# Altium schematic sheet trinamic-controller.SchDoc
size B; SheetNumber: 8; SheetTotal: 13
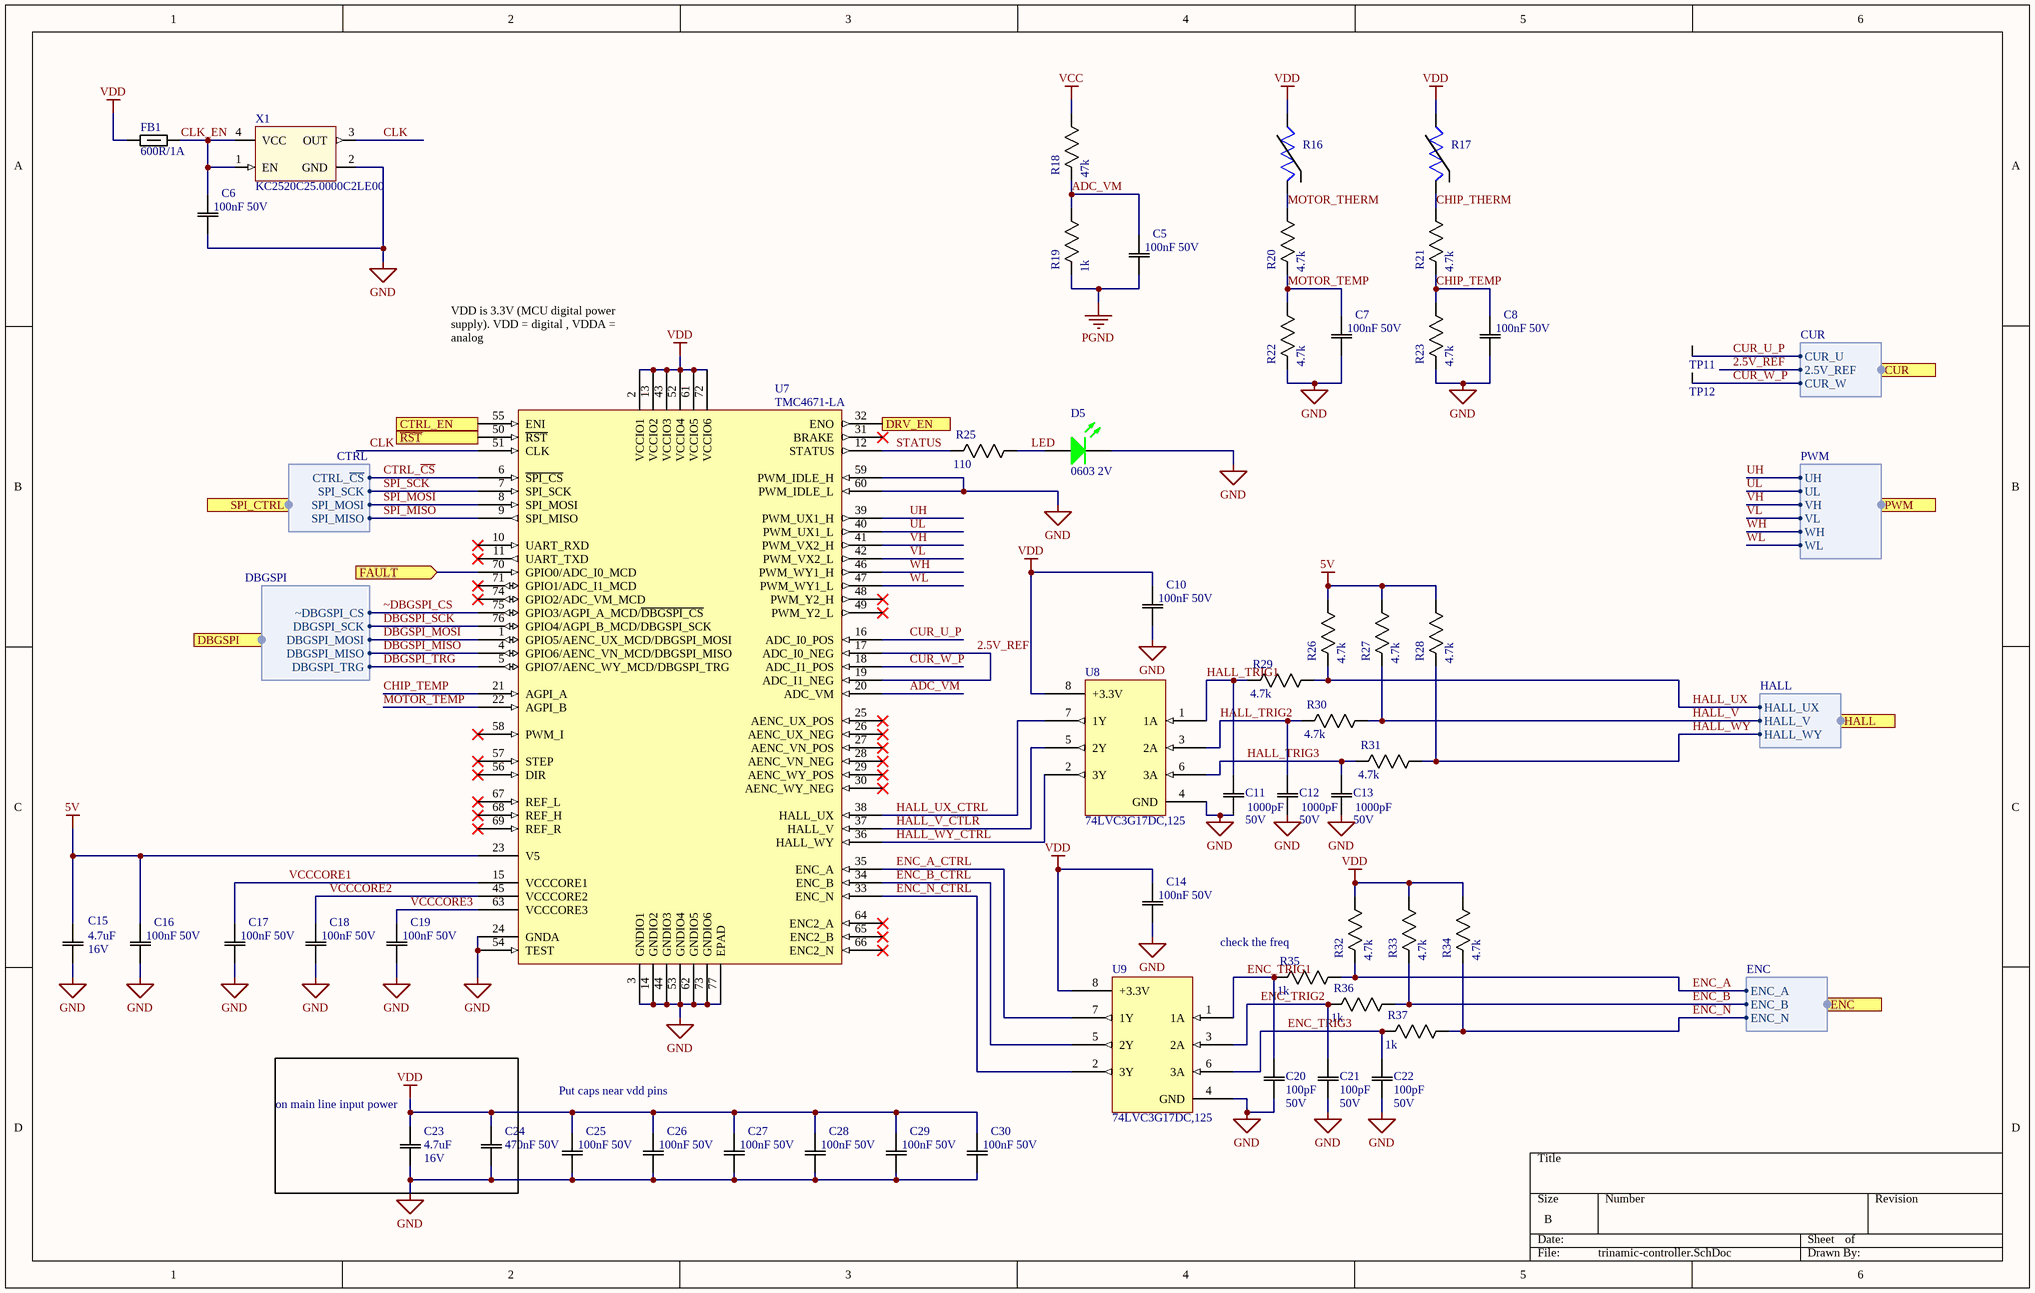
[diagram p0: trinamic-controller.SchDoc]

## Parts
C5  100nF 50V  [0603]
C6  100nF 50V  [0603]
C7  100nF 50V  [0603]
C8  100nF 50V  [0603]
C10  100nF 50V  [0603]
C11  value 1000pF  Rating: 50V  [0603]  (hidden comment: 1000pF 50V)
C12  value 1000pF  Rating: 50V  [0603]  (hidden comment: 1000pF 50V)
C13  value 1000pF  Rating: 50V  [0603]  (hidden comment: 1000pF 50V)
C14  100nF 50V  [0603]
C15  value 4.7uF  Rating: 16V  [0603]  (hidden comment: 4.7uF 16V)
C16  100nF 50V  [0603]
C17  100nF 50V  [0603]
C18  100nF 50V  [0603]
C19  100nF 50V  [0603]
C20  value 100pF  Rating: 50V  [0603]  (hidden comment: 100pF 50V)
C21  value 100pF  Rating: 50V  [0603]  (hidden comment: 100pF 50V)
C22  value 100pF  Rating: 50V  [0603]  (hidden comment: 100pF 50V)
C23  value 4.7uF  Rating: 16V  [0603]  (hidden comment: 4.7uF 16V)
C24  470nF 50V  [0603]
C25  100nF 50V  [0603]
C26  100nF 50V  [0603]
C27  100nF 50V  [0603]
C28  100nF 50V  [0603]
C29  100nF 50V  [0603]
C30  100nF 50V  [0603]
D5  0603 2V  [0603 - LED]
FB1  600R/1A  [0603]
R16  RES NTC 10k  [THERMISTOR TH]  (value not drawn)  (no BOM)
R17  RES NTC 10k  [0603]  (value not drawn)
R18  47k  [0603]
R19  1k  [0603]
R20  4.7k  [0603]
R21  4.7k  [0603]
R22  4.7k  [0603]
R23  4.7k  [0603]
R25  110  [0603]
R26  4.7k  [0603]
R27  4.7k  [0603]
R28  4.7k  [0603]
R29  4.7k  [0603]
R30  4.7k  [0603]
R31  4.7k  [0603]
R32  4.7k  [0603]
R33  4.7k  [0603]
R34  4.7k  [0603]
R35  1k  [0603]
R36  1k  [0603]
R37  1k  [0603]
TP11  C_U  [TP]  (value not drawn)  (no BOM)
TP12  C_W  [TP]  (value not drawn)  (no BOM)
U7  TMC4671-LA  [QFN40P1050X650X90_HS-77N]
U8  74LVC3G17DC,125  [8-VSSOP]
U9  74LVC3G17DC,125  [8-VSSOP]
X1  KC2520C25.0000C2LE00  [KC2520C25.0000C2LE00]

## Blocks framed on the sheet
on main line input power: C23 C24

## Ports
CTRL_EN (in), CUR (harness CUR), DBGSPI (harness DBGSPI), DRV_EN (out), ENC (harness ENC), FAULT (in), HALL (harness HALL), PWM (harness PWM), SPI_CTRL (harness CTRL), ~{RST} (in)

## Harnesses
CUR: CUR_U, CUR_W, 2.5V_REF
PWM: VL, WH, WL, VH, UL, UH
HALL: HALL_UX, HALL_WY, HALL_V
ENC: ENC_A, ENC_N, ENC_B
CTRL: SPI_SCK, SPI_MISO, SPI_MOSI, CTRL_~{CS}
DBGSPI: ~DBGSPI_CS, DBGSPI_SCK, DBGSPI_MOSI, DBGSPI_MISO, DBGSPI_TRG

## Nets
5V: C15.2(C2) C16.2(C2) R26.1(R1) R27.1(R1) R28.1(R1) U7.23(V5)
GND: C6.1(C1) C7.1(C1) C8.1(C1) C10.1(C1) C11.1(C1) C12.1(C1) C13.1(C1) C14.1(C1) C15.1(C1) C16.1(C1) C17.1(C1) C18.1(C1) C19.1(C1) C20.1(C1) C21.1(C1) C22.1(C1) C23.1(C1) C24.1(C1) C25.1(C1) C26.1(C1) C27.1(C1) C28.1(C1) C29.1(C1) C30.1(C1) D5.2(K) R22.2(R2) R23.2(R2) U7.3(GNDIO1) U7.14(GNDIO2) U7.24(GNDA) U7.44(GNDIO3) U7.53(GNDIO4) U7.54(TEST) U7.59(PWM_IDLE_H) U7.60(PWM_IDLE_L) U7.62(GNDIO5) U7.73(GNDIO6) U7.77(EPAD) U8.4(GND) U9.4(GND) X1.2(GND)
PGND: C5.1(C1) R19.2(R2)
VCC: R18.1(R1)
VDD: C10.2(C2) C14.2(C2) C23.2(C2) C24.2(C2) C25.2(C2) C26.2(C2) C27.2(C2) C28.2(C2) C29.2(C2) C30.2(C2) FB1.1 R16.2 R17.2 R32.1(R1) R33.1(R1) R34.1(R1) U7.2(VCCIO1) U7.13(VCCIO2) U7.43(VCCIO3) U7.52(VCCIO4) U7.61(VCCIO5) U7.72(VCCIO6) U8.8(+3.3V) U9.8(+3.3V)
2.5V_REF: U7.17(ADC_I0_NEG) U7.19(ADC_I1_NEG) ; port CUR.2.5V_REF
ADC_VM: C5.2(C2) R18.2(R2) R19.1(R1) U7.20(ADC_VM)
CHIP_TEMP: C8.2(C2) R21.2(R2) R23.1(R1) U7.21(AGPI_A)
CHIP_THERM: R17.1 R21.1(R1)
CLK: U7.51(CLK) X1.3(OUT)
CLK_EN: C6.2(C2) FB1.2 X1.1(EN) X1.4(VCC)
CTRL_~{CS}: U7.6(~{SPI_CS}) ; port SPI_CTRL.CTRL_~{CS}
CTRL_EN: U7.55(ENI) ; port CTRL_EN
CUR_U_P: TP11.1 U7.16(ADC_I0_POS) ; port CUR.CUR_U
CUR_W_P: TP12.1 U7.18(ADC_I1_POS) ; port CUR.CUR_W
DBGSPI_MISO: U7.4(GPIO6/AENC_VN_MCD/DBGSPI_MISO) ; port DBGSPI.DBGSPI_MISO
DBGSPI_MOSI: U7.1(GPIO5/AENC_UX_MCD/DBGSPI_MOSI) ; port DBGSPI.DBGSPI_MOSI
DBGSPI_SCK: U7.76(GPIO4/AGPI_B_MCD/DBGSPI_SCK) ; port DBGSPI.DBGSPI_SCK
DBGSPI_TRG: U7.5(GPIO7/AENC_WY_MCD/DBGSPI_TRG) ; port DBGSPI.DBGSPI_TRG
DRV_EN: U7.32(ENO) ; port DRV_EN
ENC_A: R32.2(R2) R35.1(R1) ; port ENC.ENC_A
ENC_A_CTRL: U7.35(ENC_A) U9.7(1Y)
ENC_B: R33.2(R2) R36.1(R1) ; port ENC.ENC_B
ENC_B_CTRL: U7.34(ENC_B) U9.5(2Y)
ENC_N: R34.2(R2) R37.1(R1) ; port ENC.ENC_N
ENC_N_CTRL: U7.33(ENC_N) U9.2(3Y)
ENC_TRIG1: C20.2(C2) R35.2(R2) U9.1(1A)
ENC_TRIG2: C21.2(C2) R36.2(R2) U9.3(2A)
ENC_TRIG3: C22.2(C2) R37.2(R2) U9.6(3A)
FAULT: U7.70(GPIO0/ADC_I0_MCD) ; port FAULT
HALL_TRIG1: C11.2(C2) R29.2(R2) U8.1(1A)
HALL_TRIG2: C12.2(C2) R30.2(R2) U8.3(2A)
HALL_TRIG3: C13.2(C2) R31.2(R2) U8.6(3A)
HALL_UX: R26.2(R2) R29.1(R1) ; port HALL.HALL_UX
HALL_UX_CTRL: U7.38(HALL_UX) U8.7(1Y)
HALL_V: R27.2(R2) R30.1(R1) ; port HALL.HALL_V
HALL_V_CTLR: U7.37(HALL_V) U8.5(2Y)
HALL_WY: R28.2(R2) R31.1(R1) ; port HALL.HALL_WY
HALL_WY_CTRL: U7.36(HALL_WY) U8.2(3Y)
LED: D5.1(A) R25.1(R1)
MOTOR_TEMP: C7.2(C2) R20.2(R2) R22.1(R1) U7.22(AGPI_B)
MOTOR_THERM: R16.1 R20.1(R1)
~{RST}: U7.50(~{RST}) ; port ~{RST}
SPI_MISO: U7.9(SPI_MISO) ; port SPI_CTRL.SPI_MISO
SPI_MOSI: U7.8(SPI_MOSI) ; port SPI_CTRL.SPI_MOSI
SPI_SCK: U7.7(SPI_SCK) ; port SPI_CTRL.SPI_SCK
STATUS: R25.2(R2) U7.12(STATUS)
UH: U7.39(PWM_UX1_H) ; port PWM.UH
UL: U7.40(PWM_UX1_L) ; port PWM.UL
VCCCORE1: C17.2(C2) U7.15(VCCCORE1)
VCCCORE2: C18.2(C2) U7.45(VCCCORE2)
VCCCORE3: C19.2(C2) U7.63(VCCCORE3)
VH: U7.41(PWM_VX2_H) ; port PWM.VH
VL: U7.42(PWM_VX2_L) ; port PWM.VL
WH: U7.46(PWM_WY1_H) ; port PWM.WH
WL: U7.47(PWM_WY1_L) ; port PWM.WL
~DBGSPI_CS: U7.75(GPIO3/AGPI_A_MCD/~{DBGSPI_CS}) ; port DBGSPI.~DBGSPI_CS

Not connected (* = marked no-connect by the designer): U7 10(UART_RXD)* 11(UART_TXD)* 25(AENC_UX_POS)* 26(AENC_UX_NEG)* 27(AENC_VN_POS)* 28(AENC_VN_NEG)* 29(AENC_WY_POS)* 30(AENC_WY_NEG)* 31(BRAKE)* 48(PWM_Y2_H)* 49(PWM_Y2_L)* 56(DIR)* 57(STEP)* 58(PWM_I)* 64(ENC2_A)* 65(ENC2_B)* 66(ENC2_N)* 67(REF_L)* 68(REF_H)* 69(REF_R)* 71(GPIO1/ADC_I1_MCD)* 74(GPIO2/ADC_VM_MCD)*

## Notes on the sheet
- (near U7) VDD is 3.3V (MCU digital power supply). VDD = digital , VDDA = analog
- (near R35) check the freq
- Put caps near vdd pins

## Library data of the parts
C5-C8 C10 C14 C16-C19 C25-C30 = CAP 100nF 50V: Default Symbol for Capacitors; Manufacturer Part Number 1: CC0603KPX7R9BB104; Tolerance: 10%; Temperature Coefficient: X7R; Value: 100nF; Rating: 50V; Part Number: CAP 100nF 50V; Supplier 1: Digi-Key; Supplier Part Number 1: 311-3567-1-ND; Manufacturer Part Number 2: 0805J0500104KJT; Supplier 2: Digi-Key; Supplier Part Number 2: 1608-1458-1-ND
C11-C13 = CAP 1000pF 50V: Default Symbol for Capacitors; Manufacturer Part Number 1: 06035C102K4Z2A / 06035C102K4Z2A; Tolerance: 10%; Temperature Coefficient: X7R; Part Number: CAP 1000pF 50V; Supplier 1: Digi-Key; Supplier Part Number 1: 478-6342-1-ND; Manufacturer Part Number 2: 08055C102KAT2A; Supplier 2: Digi-Key; Supplier Part Number 2: 478-1371-1-ND
C15 C23 = CAP 4.7uF 16V: Default Symbol for Capacitors; Manufacturer Part Number 1: C1608X5R1C475K080AE; Tolerance: 10%; Temperature Coefficient: X5R; Part Number: CAP 4.7uF 16V; Supplier 1: Digi-Key; Supplier Part Number 1: 445-175225-1-ND; Manufacturer Part Number 2: C2012X5R1C475K085AB; Supplier 2: Digi-Key; Supplier Part Number 2: 445-14382-1-ND
C20-C22 = CAP 100pF 50V: Default Symbol for Capacitors; Manufacturer Part Number 1: C0603C101K5RAC7867; Tolerance: 10%; Temperature Coefficient: X7R; Part Number: CAP 100pF 50V; Supplier 1: Digi-Key; Supplier Part Number 1: 399-C0603C101K5RAC7867CT-ND; Manufacturer Part Number 2: C0805C101J5RAC7800; Supplier 2: Digi-Key; Supplier Part Number 2: 399-17420-1-ND
C24 = CAP 470nF 50V: Default Symbol for Capacitors; Manufacturer Part Number 1: C1608X7R1H474K080AC; Tolerance: 10%; Temperature Coefficient: X7R; Value: 470nF; Rating: 50V; Part Number: CAP 470nF 50V; Supplier 1: Digi-Key; Supplier Part Number 1: 445-5952-1-ND; Manufacturer Part Number 2: CL21B474KBFNNNG; Supplier 2: Digi-Key; Supplier Part Number 2: 1276-6482-1-ND
D5 = LED GREEN SMD 0603: LED Uni-Color Green 574nm 2-Pin Chip LED T/R; Manufacturer Part Number 1: LTST-C190KGKT; Current Rating: 20mA; Supplier 1: Digi-Key; Supplier Part Number 1: 160-1435-1-ND; Part Number: LED GREEN SMD 0603; Supplier URL 1: https://www.digikey.ca/en/products/detail/lite-on-inc/LTST-C190KGKT/386815?s=N4IgTCBcDaIIwDYAMBaOAWAzAVjSgcgCIgC6AvkA; Pin Count: 2; Voltage Rating - DC: 2V
FB1 = FERRITE BEAD 200 MOHM 0603 1LN: WURTH ELEKTRONIK - 742792651 - Ferrite Bead, 0603 [1608 Metric], 600 ohm, 1 A, WE-CBF Series, 0.2 ohm, &#177; 25%; VALUE: 600R/1A @ 100 MHz; Supplier 1: Digi-Key; Supplier Part Number 1: 732-1593-1-ND; Part Number: FERRITE BEAD 200 MOHM 0603 1LN; Supplier URL 1: https://www.digikey.ca/en/products/detail/w%C3%BCrth-elektronik/742792651/1638997?s=N4IgTCBcDaIOwGYwFoCMBWAnAtyByAIiALoC%2BQA; Manufacturer Part Number 1: 742792651
R16 = RES NTC 10k TH: Manufacturer Part Number 1: NXRT15XH103FA1B040; Tolerance: 1%; Part Number: RES NTC 10k TH; Value: 10k; Supplier 1: Digi-Key; Supplier Part Number 1: 490-7167-ND; Supplier URL 1: https://www.digikey.ca/en/products/detail/murata-electronics/NXRT15XH103FA1B040/3900399?s=N4IgTCBcDaICwE4AMBaA7ARgGxpQOQBEQBdAXyA
R17 = RES NTC 10k CHIP: Manufacturer Part Number 1: NCU18XH103F60RB; Tolerance: 1%; Part Number: RES NTC 10k CHIP; Value: 10k; Supplier 1: Digi-Key; Supplier Part Number 1: 490-16279-1-ND; Supplier URL 1: https://www.digikey.ca/en/products/detail/murata-electronics/NCU18XH103F60RB/7363023?s=N4IgTCBcDaICwE4AMBaAjANjAdgelAcgCIgC6AvkA
R18 = RES 47k 1/8W - 1%: Default Resistor Symbol; Manufacturer Part Number 1: MCT06030C4702FP500; Power (Watts): 0.125W; Tolerance: 1%; Package: 0805; Value: 47k; Part Number: RES 47k 1/8W - 1%; Supplier 1: Digi-Key; Supplier Part Number 1: MCT0603-47.0K-CFCT-ND; Manufacturer Part Number 2: AC0805FR-0747KL; Supplier 2: Digi-Key; Supplier Part Number 2: YAG3735CT-ND; Tolerance 2: 1%; Supplier URL 1: https://www.digikey.ca/en/products/detail/vishay-beyschlag-draloric-bc-components/MCT06030C4702FP500/2607854?s=N4IgTCBcDaILIGEAqAGAbCgzAWgCwHYA6FAaWwQDFlsA5AERAF0BfIA; Supplier URL 2: https://www.digikey.ca/en/products/detail/yageo/AC0805FR-0747KL/5896858?s=N4IgTCBcDaIJoEEDiBmA7CgrAYQCoFoA5AERAF0BfIA
R19 R35-R37 = RES 1k 1/8W - 1%: Default Resistor Symbol; Manufacturer Part Number 1: MCT06030C1001FP500; Power (Watts): 0.125W; Tolerance: 1%; Package: 0805; Value: 1k; Part Number: RES 1k 1/8W - 1%; Supplier 1: Digi-Key; Supplier Part Number 1: MCT0603-1.00K-CFCT-ND; Manufacturer Part Number 2: RMCF0805FT1K00; Supplier 2: Digi-Key; Supplier Part Number 2: RMCF0805FT1K00CT-ND; Tolerance 2: 1%; Supplier URL 1: https://www.digikey.ca/en/products/detail/vishay-beyschlag-draloric-bc-components/MCT06030C1001FP500/2607821?s=N4IgTCBcDaILIGEAqAGAbCgzAWgIwDoUUBpbBAMWWwDkAREAXQF8g; Supplier URL 2: https://www.digikey.ca/en/products/detail/stackpole-electronics-inc/RMCF0805FT1K00/1760090?s=N4IgTCBcDaIEoFkDCAxADADjQVhQFQEYBpNNJPEAXQF8g
R20-R23 = RES 4.7k 1/8W - 1%: Default Resistor Symbol; Manufacturer Part Number 1: RMCF0603FT4K70; Power (Watts): 0.125W; Tolerance: 1%; Package: 0805; Value: 4.7k; Part Number: RES 4.7k 1/8W - 1%; Supplier 1: Digi-Key; Supplier Part Number 1: RMCF0603FT4K70CT-ND; Supplier URL 1: https://www.digikey.ca/en/products/detail/stackpole-electronics-inc/RMCF0603FT4K70/1760998
R25 = RES 110.0 1/8W - 1%: Default Resistor Symbol; Manufacturer Part Number 1: RMCF0603FT110R; Power (Watts): 0.125W; Tolerance: 1%; Package: 0805; Value: 110; Part Number: RES 110.0 1/8W - 1%; Supplier 1: Digi-Key; Supplier Part Number 1: RMCF0603FT110RCT-ND; Supplier URL 1: https://www.digikey.ca/en/products/detail/stackpole-electronics-inc/RMCF0603FT110R/1761268
R26-R34 = RES 4.7k 1/8W - 5%: Default Resistor Symbol; Manufacturer Part Number 1: RMCF0603JT4K70; Power (Watts): 0.125W; Tolerance: 5%; Package: 0805; Value: 4.7k; Part Number: RES 4.7k 1/8W - 5%; Supplier 1: Digi-Key; Supplier Part Number 1: RMCF0603JT4K70CT-ND; Supplier URL 1: https://www.digikey.ca/en/products/detail/stackpole-electronics-inc/RMCF0603JT4K70/1757976
TP11 TP12 = Test Point (Via): Part Number: Test Point (Via)
U7 = TMC4671: Motor Driver, -40 To 125Deg C Rohs Compliant: Yes; Supplier 1: Digi-Key; Supplier Part Number 1: 1460-TMC4671-LA-ND; Part Number: TMC4671; Supplier URL 1: https://www.digikey.ca/en/products/detail/trinamic-motion-control-gmbh/TMC4671-LA/12174669?s=N4IgTCBcDaIIwBYBsAGAtAFQLIGFkHY40AZAQTQDkAREAXQF8g; Manufacturer Part Number 1: TMC4671-LA
U8 U9 = IC 74LVC3G17DC,125: IC BUFFER TRIPLE SCHMITT TRIGGER 5.5V VSSOP-8; Supplier 1: Newark; Supplier Part Number 1: 33AC1281; Part Number: IC 74LVC3G17DC,125; Supplier URL 1: https://canada.newark.com/nexperia/74lvc3g17dc-125/buffer-non-inverting-triple-vssop/dp/33AC1281?ost=33ac1281; Manufacturer Part Number 1: 74LVC3G17DC,125
X1 = XTAL OSC 25MHz 3.3V: Oscillator XO 25MHz ±15ppm 15pF CMOS 55% 2.5V/3.3V 4-Pin Mini-CSMD T/R; Frequency: 32.768kHz; Load Capacitance: 12.5pF; Supplier 1: Digi-Key; Supplier Part Number 1: 1253-1254-6-ND; Part Number: XTAL OSC 25MHz 3.3V; Supplier URL 1: https://www.digikey.ca/en/products/detail/kyocera-avx/KC2520C25-0000C2LE00/4867084?s=N4IgTCBcDaIIxgKwGYC0DEBZUDZUDkAREAXQF8g; Manufacturer Part Number 1: KC2520C25.0000C2LE00